# Altium schematic sheet Display.SchDoc
size A3; SheetNumber: 16; SheetTotal: 18
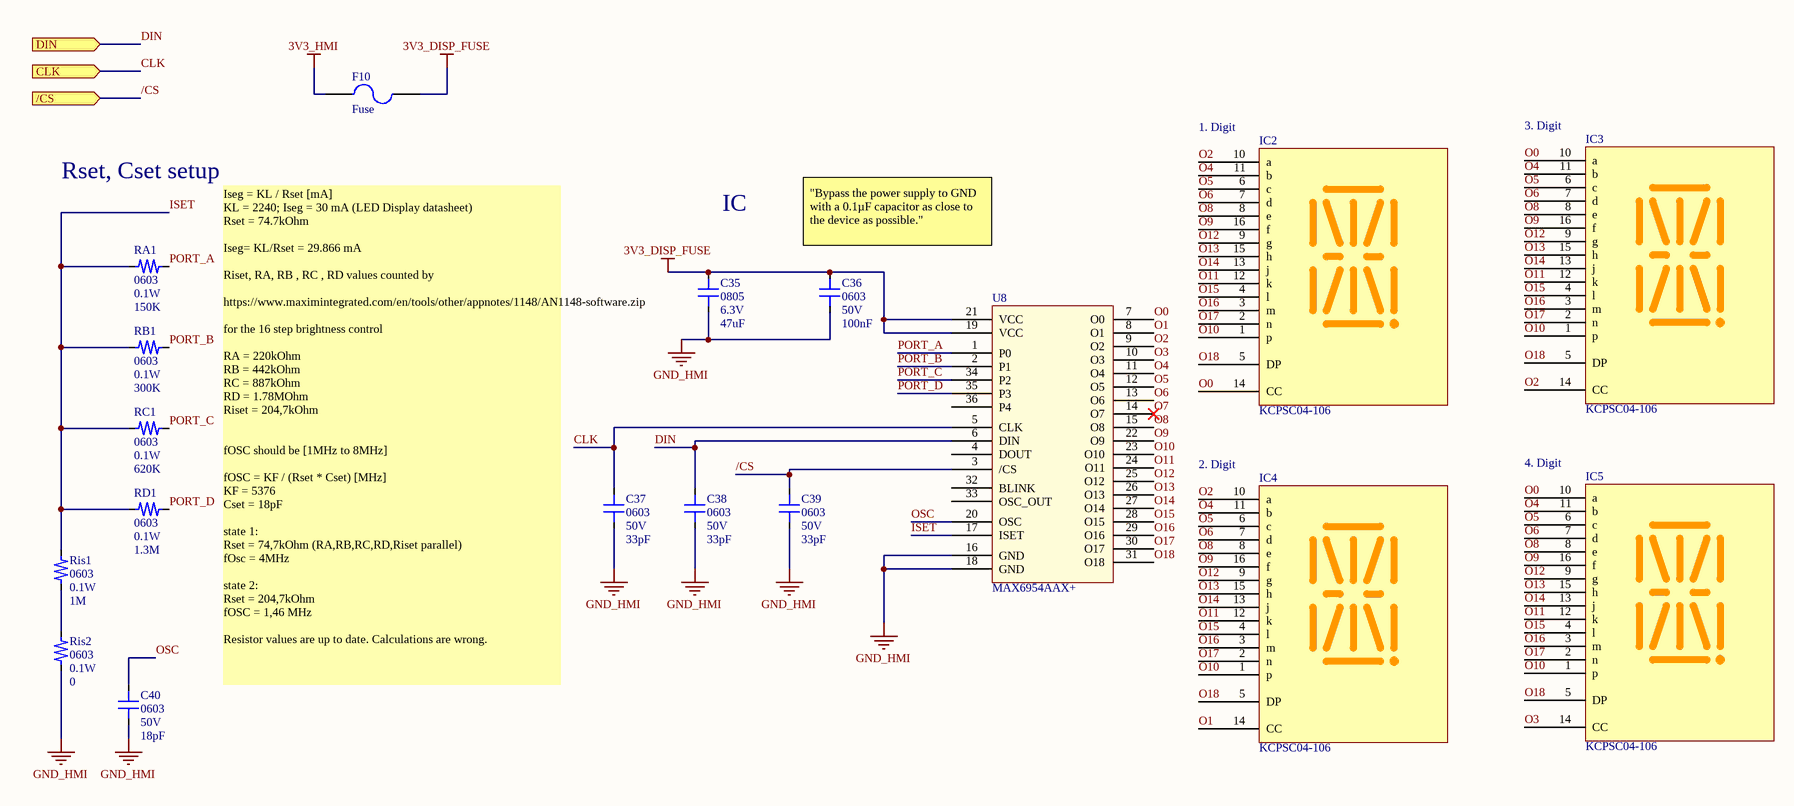
[diagram p0: Display.SchDoc]

## Parts
C35  0805  value 47uF  Rating: 6.3V  [C_0805]
C36  0603  value 100nF  Rating: 50V  [C_0603]
C37  0603  value 33pF  Rating: 50V  [C_0603]
C38  0603  value 33pF  Rating: 50V  [C_0603]
C39  0603  value 33pF  Rating: 50V  [C_0603]
C40  0603  value 18pF  Rating: 50V  [C_0603]
F10  Fuse  [F_0603]
IC2  KCPSC04-106  [KCPSC04-106]
IC3  KCPSC04-106  [KCPSC04-106]
IC4  KCPSC04-106  [KCPSC04-106]
IC5  KCPSC04-106  [KCPSC04-106]
RA1  0603  value 150K  Rating: 0.1W  [R_0603]
RB1  0603  value 300K  Rating: 0.1W  [R_0603]
RC1  0603  value 620K  Rating: 0.1W  [R_0603]
RD1  0603  value 1.3M  Rating: 0.1W  [R_0603]
Ris1  0603  value 1M  Rating: 0.1W  [R_0603]
Ris2  0603  value 0  Rating: 0.1W  [R_0603]
U8  MAX6954AAX+  [TSSOP-36]

## Ports
/CS (in), CLK (in), DIN (in)

## Nets
3V3_DISP_FUSE: C35.2(C2) C36.2(C2) F10.2 U8.19(VCC) U8.21(VCC)
3V3_HMI: F10.1
GND_HMI: C35.1(C1) C36.1(C1) C37.1(C1) C38.1(C1) C39.1(C1) C40.1(C1) Ris2.1(R1) U8.16(GND) U8.18(GND)
/CS: C39.2(C2) U8.3(/CS) ; port /CS
CLK: C37.2(C2) U8.5(CLK) ; port CLK
DIN: C38.2(C2) U8.6(DIN) ; port DIN
ISET: RA1.2(R2) RB1.2(R2) RC1.2(R2) RD1.2(R2) Ris1.2(R2) U8.17(ISET)
O0: IC2.14(CC) IC3.10(a) IC5.10(a) U8.7(O0)
O1: IC4.14(CC) U8.8(O1)
O2: IC2.10(a) IC3.14(CC) IC4.10(a) U8.9(O2)
O3: IC5.14(CC) U8.10(O3)
O4: IC2.11(b) IC3.11(b) IC4.11(b) IC5.11(b) U8.11(O4)
O5: IC2.6(c) IC3.6(c) IC4.6(c) IC5.6(c) U8.12(O5)
O6: IC2.7(d) IC3.7(d) IC4.7(d) IC5.7(d) U8.13(O6)
O7: U8.14(O7)
O8: IC2.8(e) IC3.8(e) IC4.8(e) IC5.8(e) U8.15(O8)
O9: IC2.16(f) IC3.16(f) IC4.16(f) IC5.16(f) U8.22(O9)
O10: IC2.1(p) IC3.1(p) IC4.1(p) IC5.1(p) U8.23(O10)
O11: IC2.12(k) IC3.12(k) IC4.12(k) IC5.12(k) U8.24(O11)
O12: IC2.9(g) IC3.9(g) IC4.9(g) IC5.9(g) U8.25(O12)
O13: IC2.15(h) IC3.15(h) IC4.15(h) IC5.15(h) U8.26(O13)
O14: IC2.13(j) IC3.13(j) IC4.13(j) IC5.13(j) U8.27(O14)
O15: IC2.4(l) IC3.4(l) IC4.4(l) IC5.4(l) U8.28(O15)
O16: IC2.3(m) IC3.3(m) IC4.3(m) IC5.3(m) U8.29(O16)
O17: IC2.2(n) IC3.2(n) IC4.2(n) IC5.2(n) U8.30(O17)
O18: IC2.5(DP) IC3.5(DP) IC4.5(DP) IC5.5(DP) U8.31(O18)
OSC: C40.2(C2) U8.20(OSC)
PORT_A: RA1.1(R1) U8.1(P0)
PORT_B: RB1.1(R1) U8.2(P1)
PORT_C: RC1.1(R1) U8.34(P2)
PORT_D: RD1.1(R1) U8.35(P3)
NetRis1_1: Ris1.1(R1) Ris2.2(R2)

Not connected (* = marked no-connect by the designer): U8 4(DOUT) 32(BLINK) 33(OSC_OUT) 36(P4)

## Notes on the sheet
- (near IC2) 1. Digit
- (near IC3) 3. Digit
- Rset, Cset setup
- IC
- (near C36) "Bypass the power supply to GND with a 0.1µF capacitor as close to the device as possible."
- (near IC4) 2. Digit
- (near IC5) 4. Digit
- Iseg = KL / Rset [mA]
  KL = 2240; Iseg = 30 mA (LED Display datasheet)
  Rset = 74.7kOhm
  Iseg= KL/Rset = 29.866 mA
  Riset, RA, RB , RC , RD values counted by
  https://www.maximintegrated.com/en/tools/other/appnotes/1148/AN1148-software.zip
  for the 16 step brightness control
  RA = 220kOhm
  RB = 442kOhm
  RC = 887kOhm
  RD = 1.78MOhm
  Riset = 204,7kOhm
  fOSC should be [1MHz to 8MHz]
  fOSC = KF / (Rset * Cset) [MHz]
  KF = 5376
  Cset = 18pF
  state 1:
  Rset = 74,7kOhm (RA,RB,RC,RD,Riset parallel)
  fOsc = 4MHz
  state 2:
  Rset = 204,7kOhm
  fOSC = 1,46 MHz
  Resistor values are up to date. Calculations are wrong.

## Library data of the parts
C35 = Cap_0805_47uF_6.3V_Chip: Part Number: CL21A476MQYNNNE; Type: Chip Capacitor; Tolerance: 20%; Order Number: 82-08-66; Distributor: Lomex; Link: http://lomex.hu/hu/webshop/#/page,0/search,82-08-66/stype,1/sidx,1; Price (HUF): 2.00; Package: 0805; ID: Cap_0805_47uF_6.3V_Chip; NI Part Number: -; NI PEN/DEB: -
C36 = Cap_0603_100nF_50V_Chip: Part Number: CC0603KRX7R9BB104; NI Part Number: 716340-01; Type: Chip Capacitor; Tolerance: 10%; NI PEN/DEB: DEB; Order Number: 82-06-23; Distributor: Lomex; Link: http://lomex.hu/hu/webshop/#/page,0/search,82-06-23/stype,1/sidx,1; Price (HUF): 2.00; Package: 0603; ID: Cap_0603_100nF_50V_Chip
C37-C39 = Cap_0603_33pF_50V_Chip: Part Number: CL10C330JB8NNNC; NI Part Number: 715511-01; Type: Chip Capacitor; Tolerance: 5%; NI PEN/DEB: DEB; Order Number: 82-09-74; Distributor: Lomex; Link: http://lomex.hu/hu/webshop/#/page,0/search,82-09-74/stype,1/sidx,1; Price (HUF): 2.00; Package: 0603; ID: Cap_0603_33pF_50V_Chip
C40 = Cap_0603_18pF_50V_Chip: Part Number: CL10C180JB8NNNC; NI Part Number: 715742-01; Type: Chip Capacitor; Tolerance: 5%; NI PEN/DEB: DEB; Order Number: 82-06-54; Distributor: Lomex; Link: http://lomex.hu/hu/webshop/#/page,0/search,82-06-54/stype,1/sidx,1; Price (HUF): 2.00; Package: 0603; ID: Cap_0603_18pF_50V_Chip
F10 = Oth_0438001.WR_F_0603: NI part number: 766308-01; Order number: 2413034; Rating: 32VDC; Type: Very Fast Acting Fuse; Value: 1A; NI PEN/DEB: DEB; Distributor: Farnell; ID: Oth_0438001.WR_F_0603; Link: http://hu.farnell.com/littelfuse/0438001-wr/fuse-smd-1a-0603-fast-acting-full/dp/2413034?ost=0438001.WR&selectedCategoryId=&categoryNameResp=%25C3%2596sszes%2Bkateg%25C3%25B3ria&searchView=table&iscrfnonsku=false; Package: F_0603; Part Number: 0438001.WR; Price (HUF): 142
IC2-IC5 = 14SegmentDisplaySingle: Distributor: Farnell; Link: http://hu.farnell.com/kingbright/kcpsc04-106/led-alpha-num-10-16mm-orange/dp/2449716; Type: 14SegmentDisplaySingle
RA1 RB1 RC1 RD1 = Res_0603_220K_0.1W_Chip: Part Number: CR-03FL7--220K; NI part number: 612705-01; Tolerance: 1%; NI PEN/DEB: DEB; Type: Chip Resistor; Order Number: 80-11-75; Distributor: Lomex; Price (HUF): 0.80; Package: 0603; ID: Res_0603_220K_0.1W_Chip
  RA1: Link: http://lomex.hu/hu/webshop/#/page,0/search,80-11-75/stype,1/sidx,1
  RB1: Link: http://lomex.hu/hu/webshop/#/search,80-45-26/stype,1
  RC1: Link: http://lomex.hu/hu/webshop/#/search,80-45-61/stype,1
  RD1: Link: http://lomex.hu/hu/webshop/#/search,80-49-35/stype,1
Ris1 = Res_0603_4K70_0.1W_Chip: Part Number: CR-03FL7---4K7; NI part number: 713782-01; Tolerance: 1%; NI PEN/DEB: PEN; Type: Chip Resistor; Order Number: 80-11-85; Distributor: Lomex; Link: http://lomex.hu/hu/webshop/#/page,0/search,80-11-85/stype,1/sidx,1; Price (HUF): 0.80; Package: 0603; ID: Res_0603_4K70_0.1W_Chip
Ris2 = Res_0603_200K_0.1W_Chip: Part Number: CR-03FL7--200K; NI part number: 713614-01; Tolerance: 1%; NI PEN/DEB: PEN; Type: Chip Resistor; Order Number: 80-13-51; Distributor: Lomex; Link: http://lomex.hu/hu/webshop/#/page,0/search,80-13-51/stype,1/sidx,1; Price (HUF): 0.80; Package: 0603; ID: Res_0603_200K_0.1W_Chip
U8 = IC_MAX6954AAX+_TSSOP-36: 16 Segment LED Driver; Order number: 2113136; Distributor: Farnell; Link: http://hu.farnell.com/maxim-integrated-products/max6954aax/driver-led-16x7seg-8x16seg-128/dp/2113136; Value: *; ID: IC_MAX6954AAX+_TSSOP-36; Note: MAX6954; Package: TSSOP-36; Part Number: MAX6954AAX+; Price (HUF): 7470; Type: 16 Segment LED Driver; NI part number: -; NI PEN/DEB: -